# Altium project RX_Board.PrjPcb (part 3 of 5)
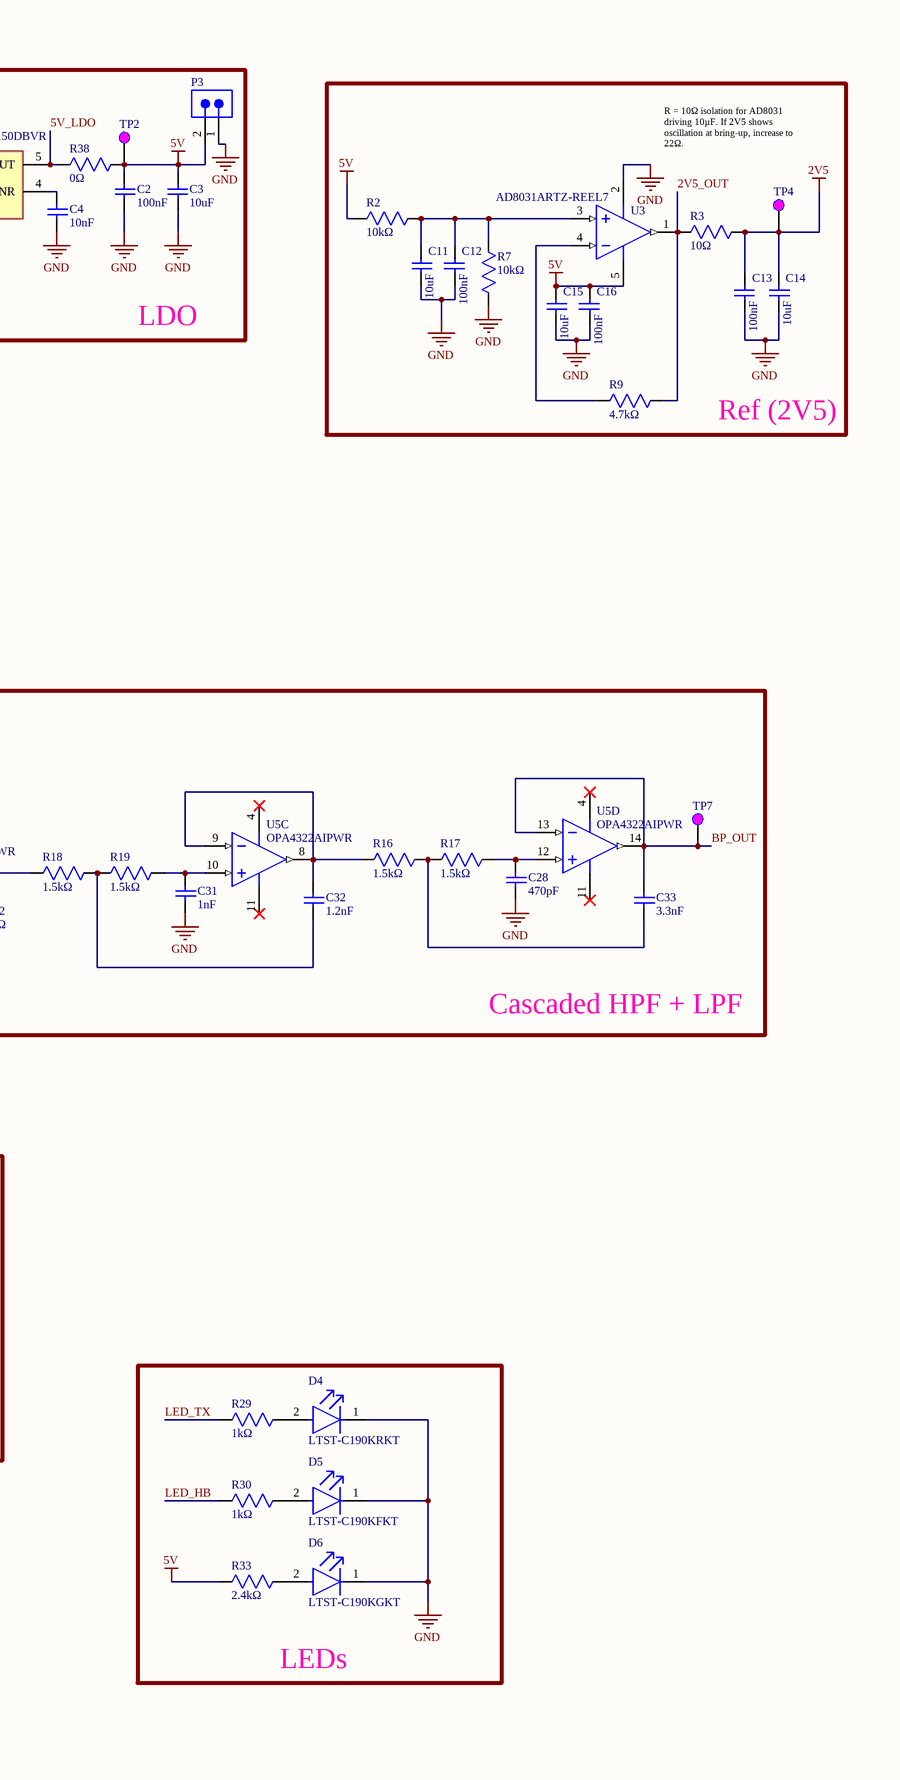
[diagram p3: RX_Board.SchDoc, right]

## Sheet RX_Board.SchDoc (continued)

### Library data of the parts (continued)
C28 = CC0603FRNPO9BN471: 50V 470pF NP0 ±1% 0603 Multilayer Ceramic Capacitors MLCC - SMD/SMT ROHS; Manufacturer: Yageo Group; Dielectric: C0G; Dissipation Factor: 0.1%; Insulation Resistance: 10GΩ; Supplier: Newark; Supplier Part Number: CC0603FRNPO9BN471; Manufacturer Part Number: CC0603FRNPO9BN471; RoHS: Compliant; Category: Ceramic Capacitors; Stock: 7080; Pricing: 1=0.0986, 11=0.0703, 101=0.0582, 501=0.0554, 1001=0.0547 (USD); Value: 470pF; Case/Package: 0603; Case Code (Imperial): 0603; Case Code (Metric): 1608; China RoHS: Compliant; Composition: Ceramic; Depth: 800µm; Dielectric Material: Ceramic; Halogen Free: Halogen Free; Height: 800µm; Lead Free: Lead Free; Length: 1.6mm; Lifecycle Status: Production; Max Operating Temperature: 125°C; Min Operating Temperature: -55°C; Mounting Technology: Surface Mount; Number of Terminals: 2; Packaging: Tape and Reel; Radiation Hardening: No; REACH SVHC: Unaffected; Schedule B: 8532240020, 8532240020|8532240020, 8532240020|8532240020|8532240020, 8532240020|8532240020|8532240020|8532240020; Termination: SMD/SMT; Thickness: 889µm; Tolerance: 1%; Voltage Rating: 50V; Voltage Rating (DC): 50V; Width: 800µm; ComponentLink1URL: https://datasheet.octopart.com:443/CC0603FRNPO9BN471-Yageo-datasheet-182140217.pdf?src-supplier=IHS; ComponentLink1Description: https://datasheet.octopart.com:443/CC0603FRNPO9BN471-Yageo-datasheet-182140217.pdf?src-supplier=IHS; ComponentLink2URL: https://datasheet.octopart.com:443/CC0603FRNPO9BN471-Yageo-datasheet-151948684.pdf?src-supplier=HQonline; ComponentLink2Description: https://datasheet.octopart.com:443/CC0603FRNPO9BN471-Yageo-datasheet-151948684.pdf?src-supplier=HQonline; ComponentLink3URL: https://datasheet.octopart.com:443/CC0603FRNPO9BN471-Yageo-datasheet-182029577.pdf?src-supplier=Newark; ComponentLink3Description: https://datasheet.octopart.com:443/CC0603FRNPO9BN471-Yageo-datasheet-182029577.pdf?src-supplier=Newark; ComponentLink4URL: https://datasheet.octopart.com:443/CC0603FRNPO9BN471-Yageo-datasheet-182029576.pdf?src-supplier=Newark; ComponentLink4Description: https://datasheet.octopart.com:443/CC0603FRNPO9BN471-Yageo-datasheet-182029576.pdf?src-supplier=Newark; ComponentLink5URL: https://datasheet.octopart.com:443/CC0603FRNPO9BN471-Yageo-Group-datasheet-188129580.pdf?src-supplier=LCSC; ComponentLink5Description: https://datasheet.octopart.com:443/CC0603FRNPO9BN471-Yageo-Group-datasheet-188129580.pdf?src-supplier=LCSC; ComponentLink6URL: https://datasheet.octopart.com:443/CC0603FRNPO9BN471-Yageo-datasheet-137875056.pdf?src-supplier=Future+Electronics; ComponentLink6Description: https://datasheet.octopart.com:443/CC0603FRNPO9BN471-Yageo-datasheet-137875056.pdf?src-supplier=Future+Electronics; ComponentLink7URL: https://datasheet.octopart.com:443/CC0603FRNPO9BN471-Yageo-datasheet-136957424.pdf?src-supplier=Future+Electronics; ComponentLink7Description: https://datasheet.octopart.com:443/CC0603FRNPO9BN471-Yageo-datasheet-136957424.pdf?src-supplier=Future+Electronics; ComponentLink8URL: https://datasheet.octopart.com:443/CC0603FRNPO9BN471-Yageo-datasheet-137700082.pdf?src-supplier=Future+Electronics; ComponentLink8Description: https://datasheet.octopart.com:443/CC0603FRNPO9BN471-Yageo-datasheet-137700082.pdf?src-supplier=Future+Electronics; ComponentLink9URL: https://datasheet.octopart.com:443/CC0603FRNPO9BN471-Yageo-datasheet-78855684.pdf?src-supplier=Future+Electronics; ComponentLink9Description: https://datasheet.octopart.com:443/CC0603FRNPO9BN471-Yageo-datasheet-78855684.pdf?src-supplier=Future+Electronics; ComponentLink10URL: https://datasheet.octopart.com:443/CC0603FRNPO9BN471-Yageo-datasheet-16730043.pdf?src-supplier=Future+Electronics; ComponentLink10Description: https://datasheet.octopart.com:443/CC0603FRNPO9BN471-Yageo-datasheet-16730043.pdf?src-supplier=Future+Electronics; ComponentLink11URL: https://datasheet.octopart.com:443/CC0603FRNPO9BN471-Yageo-datasheet-15895757.pdf?src-supplier=Future+Electronics; ComponentLink11Description: https://datasheet.octopart.com:443/CC0603FRNPO9BN471-Yageo-datasheet-15895757.pdf?src-supplier=Future+Electronics; ComponentLink12URL: https://datasheet.octopart.com:443/CC0603FRNPO9BN471-Yageo-datasheet-12589826.pdf?src-supplier=Future+Electronics; ComponentLink12Description: https://datasheet.octopart.com:443/CC0603FRNPO9BN471-Yageo-datasheet-12589826.pdf?src-supplier=Future+Electronics; ComponentLink13URL: https://datasheet.octopart.com:443/CC0603FRNPO9BN471-Yageo-datasheet-10406438.pdf?src-supplier=Future+Electronics; ComponentLink13Description: https://datasheet.octopart.com:443/CC0603FRNPO9BN471-Yageo-datasheet-10406438.pdf?src-supplier=Future+Electronics; ComponentLink14URL: http://sigma.octopart.com:80/conflict_mineral_statement/Yageo-company-3.pdf?src-supplier=Compliance+Statements; ComponentLink14Description: http://sigma.octopart.com:80/conflict_mineral_statement/Yageo-company-3.pdf?src-supplier=Compliance+Statements; ComponentLink15URL: http://sigma.octopart.com:80/rohs_statement/Yageo-company-2.pdf?src-supplier=Compliance+Statements; ComponentLink15Description: http://sigma.octopart.com:80/rohs_statement/Yageo-company-2.pdf?src-supplier=Compliance+Statements; JLCPCB Part Number: C519564
C32 = CC0603JRNPO9BN122: 50V 1.2nF NP0 ±5% 0603 Multilayer Ceramic Capacitors MLCC - SMD/SMT ROHS; Manufacturer: Yageo Group; Supplier: Newark; Supplier Part Number: CC0603JRNPO9BN122; Manufacturer Part Number: CC0603JRNPO9BN122; RoHS: Compliant; Category: Ceramic Capacitors; Stock: 4890; Pricing: 10=0.09, 20=0.088, 30=0.085, 50=0.083, 100=0.08, 250=0.079, 500=0.078, 1000=0.057 (USD); Value: 1.2nF; Case/Package: 0603; China RoHS: Compliant; Dielectric Material: Ceramic; Halogen Free: Halogen Free; Height: 800µm; Lead Free: Lead Free; Length: 1.6mm; Lifecycle Status: Production; Max Operating Temperature: 125°C; Min Operating Temperature: -55°C; Mounting Technology: Surface Mount; Number of Terminals: 2; Packaging: Tape & Reel (TR); REACH SVHC: Unaffected; Thickness: 889µm; Tolerance: 5%; Voltage Rating: 50V; Voltage Rating (DC): 50V; Width: 800µm; ComponentLink1URL: https://datasheet.octopart.com:443/CC0603JRNPO9BN122-Yageo-datasheet-182140217.pdf?src-supplier=IHS; ComponentLink1Description: https://datasheet.octopart.com:443/CC0603JRNPO9BN122-Yageo-datasheet-182140217.pdf?src-supplier=IHS; ComponentLink2URL: https://datasheet.octopart.com:443/CC0603JRNPO9BN122-Yageo-datasheet-182029623.pdf?src-supplier=Farnell; ComponentLink2Description: https://datasheet.octopart.com:443/CC0603JRNPO9BN122-Yageo-datasheet-182029623.pdf?src-supplier=Farnell; ComponentLink3URL: https://datasheet.octopart.com:443/CC0603JRNPO9BN122-Yageo-Group-datasheet-188129580.pdf?src-supplier=LCSC; ComponentLink3Description: https://datasheet.octopart.com:443/CC0603JRNPO9BN122-Yageo-Group-datasheet-188129580.pdf?src-supplier=LCSC; ComponentLink4URL: https://datasheet.octopart.com:443/CC0603JRNPO9BN122-Yageo-datasheet-137875056.pdf?src-supplier=Future+Electronics; ComponentLink4Description: https://datasheet.octopart.com:443/CC0603JRNPO9BN122-Yageo-datasheet-137875056.pdf?src-supplier=Future+Electronics; ComponentLink5URL: https://datasheet.octopart.com:443/CC0603JRNPO9BN122-Yageo-datasheet-136957424.pdf?src-supplier=Future+Electronics; ComponentLink5Description: https://datasheet.octopart.com:443/CC0603JRNPO9BN122-Yageo-datasheet-136957424.pdf?src-supplier=Future+Electronics; ComponentLink6URL: https://datasheet.octopart.com:443/CC0603JRNPO9BN122-Yageo-datasheet-137700082.pdf?src-supplier=Future+Electronics; ComponentLink6Description: https://datasheet.octopart.com:443/CC0603JRNPO9BN122-Yageo-datasheet-137700082.pdf?src-supplier=Future+Electronics; ComponentLink7URL: https://datasheet.octopart.com:443/CC0603JRNPO9BN122-Yageo-datasheet-78855684.pdf?src-supplier=Future+Electronics; ComponentLink7Description: https://datasheet.octopart.com:443/CC0603JRNPO9BN122-Yageo-datasheet-78855684.pdf?src-supplier=Future+Electronics; ComponentLink8URL: https://datasheet.octopart.com:443/CC0603JRNPO9BN122-Yageo-datasheet-62126864.pdf?src-supplier=Future+Electronics; ComponentLink8Description: https://datasheet.octopart.com:443/CC0603JRNPO9BN122-Yageo-datasheet-62126864.pdf?src-supplier=Future+Electronics; ComponentLink9URL: https://datasheet.octopart.com:443/CC0603JRNPO9BN122-Yageo-datasheet-62091628.pdf?src-supplier=Future+Electronics; ComponentLink9Description: https://datasheet.octopart.com:443/CC0603JRNPO9BN122-Yageo-datasheet-62091628.pdf?src-supplier=Future+Electronics; ComponentLink10URL: https://datasheet.octopart.com:443/CC0603JRNPO9BN122-Yageo-datasheet-24578986.pdf?src-supplier=Future+Electronics; ComponentLink10Description: https://datasheet.octopart.com:443/CC0603JRNPO9BN122-Yageo-datasheet-24578986.pdf?src-supplier=Future+Electronics; ComponentLink11URL: https://datasheet.octopart.com:443/CC0603JRNPO9BN122-Yageo-datasheet-10406438.pdf?src-supplier=Future+Electronics; ComponentLink11Description: https://datasheet.octopart.com:443/CC0603JRNPO9BN122-Yageo-datasheet-10406438.pdf?src-supplier=Future+Electronics; ComponentLink12URL: http://sigma.octopart.com:80/conflict_mineral_statement/Yageo-company-3.pdf?src-supplier=Compliance+Statements; ComponentLink12Description: http://sigma.octopart.com:80/conflict_mineral_statement/Yageo-company-3.pdf?src-supplier=Compliance+Statements; ComponentLink13URL: http://sigma.octopart.com:80/rohs_statement/Yageo-company-2.pdf?src-supplier=Compliance+Statements; ComponentLink13Description: http://sigma.octopart.com:80/rohs_statement/Yageo-company-2.pdf?src-supplier=Compliance+Statements; JLCPCB Part Number: C576816
C33 C43 = CC0603JRNPO9BN332: 50V 3.3nF NP0 ±5% 0603 Multilayer Ceramic Capacitors MLCC - SMD/SMT ROHS; Manufacturer: Yageo Group; Dielectric: C0G; Supplier: Newark; Supplier Part Number: CC0603JRNPO9BN332; Manufacturer Part Number: CC0603JRNPO9BN332; RoHS: Compliant; Category: Ceramic Capacitors; Stock: 69; Pricing: 10=0.116, 20=0.113, 30=0.11, 50=0.106, 100=0.103, 250=0.092, 500=0.08, 1000=0.073 (USD); Value: 3.3nF; Case/Package: 0603; Case Code (Imperial): 0603; Case Code (Metric): 1608; China RoHS: Compliant; Composition: Ceramic; Country of Origin: Mainland China, Taiwan; Dielectric Material: Ceramic; Export Control Classification Number (ECCN) Code: EAR99; Halogen Free: Halogen Free; Height: 800µm; Harmonized Tariff Schedule (HTS) Code: 8532.24.00.20; Introduction Date: 2014-02-18; Lead Free: Lead Free; Length: 1.6mm; Lifecycle Status: Production; Max Operating Temperature: 125°C; Min Operating Temperature: -55°C; Mounting Technology: Surface Mount; Number of Terminals: 2; REACH SVHC: Unaffected; Schedule B: 8532240020, 8532240020|8532240020|8532240020|8532240020|8532240020; Termination: SMD/SMT; Thickness: 889µm; Tolerance: 5%; Voltage Rating: 50V; Voltage Rating (DC): 50V; Weight: 2.012816mg; Width: 800µm; ComponentLink1URL: https://datasheet.octopart.com:443/CC0603JRNPO9BN332-Yageo-datasheet-182140217.pdf?src-supplier=IHS; ComponentLink1Description: https://datasheet.octopart.com:443/CC0603JRNPO9BN332-Yageo-datasheet-182140217.pdf?src-supplier=IHS; ComponentLink2URL: https://datasheet.octopart.com:443/CC0603JRNPO9BN332-Yageo-datasheet-182029633.pdf?src-supplier=Newark; ComponentLink2Description: https://datasheet.octopart.com:443/CC0603JRNPO9BN332-Yageo-datasheet-182029633.pdf?src-supplier=Newark; ComponentLink3URL: https://datasheet.octopart.com:443/CC0603JRNPO9BN332-Yageo-datasheet-151948684.pdf?src-supplier=element14+APAC; ComponentLink3Description: https://datasheet.octopart.com:443/CC0603JRNPO9BN332-Yageo-datasheet-151948684.pdf?src-supplier=element14+APAC; ComponentLink4URL: https://datasheet.octopart.com:443/CC0603JRNPO9BN332-Yageo-datasheet-137875056.pdf?src-supplier=Future+Electronics; ComponentLink4Description: https://datasheet.octopart.com:443/CC0603JRNPO9BN332-Yageo-datasheet-137875056.pdf?src-supplier=Future+Electronics; ComponentLink5URL: https://datasheet.octopart.com:443/CC0603JRNPO9BN332-Yageo-datasheet-137700082.pdf?src-supplier=Future+Electronics; ComponentLink5Description: https://datasheet.octopart.com:443/CC0603JRNPO9BN332-Yageo-datasheet-137700082.pdf?src-supplier=Future+Electronics; ComponentLink6URL: http://sigma.octopart.com:80/conflict_mineral_statement/Yageo-company-3.pdf?src-supplier=Compliance+Statements; ComponentLink6Description: http://sigma.octopart.com:80/conflict_mineral_statement/Yageo-company-3.pdf?src-supplier=Compliance+Statements; ComponentLink7URL: http://sigma.octopart.com:80/rohs_statement/Yageo-company-2.pdf?src-supplier=Compliance+Statements; ComponentLink7Description: http://sigma.octopart.com:80/rohs_statement/Yageo-company-2.pdf?src-supplier=Compliance+Statements; JLCPCB Part Number: C107048
C35 C42 = CC0603JRNPO9BN680: Multilayer Ceramic Capacitor, 68 pF, 50 V, ± 5%, C0G (NP0), 0603 [1608 Metric]; Manufacturer: Yageo Group; Dissipation Factor: 0.1%; Temperature Coefficient: 30ppm/°C; Voltage: 50V; Supplier: Avnet; Supplier Part Number: CC0603JRNPO9BN680; Manufacturer Part Number: CC0603JRNPO9BN680; RoHS: Compliant; Category: Ceramic Capacitors; Stock: 37; Pricing: 1=0.112, 25=0.033, 100=0.028, 250=0.025, 500=0.021, 1000=0.019, 2500=0.017 (USD); Value: 68pF; Case/Package: 0603; Case Code (Imperial): 0603; China RoHS: Compliant; Composition: Ceramic; Country of Origin: Mainland China, Taiwan; Depth: 800µm; Dielectric: C0G; Dielectric Material: Ceramic; Export Control Classification Number (ECCN) Code: EAR99; Halogen Free: Halogen Free; Height: 800µm; Harmonized Tariff Schedule (HTS) Code: 8532.24.00.20; Introduction Date: 2009-04-16; Lead Free: Lead Free; Length: 1.6mm; Lifecycle Status: Production; Max Operating Temperature: 125°C; Min Operating Temperature: -55°C; Mounting Technology: Surface Mount; Pins: 2; Number of Terminals: 2; Radiation Hardening: No; REACH SVHC: Unaffected; Schedule B: 8532240020, 8532240020|8532240020, 8532240020|8532240020|8532240020, 8532240020|8532240020|8532240020|8532240020; Termination: SMD/SMT; Thickness: 889µm; Tolerance: 5%; Voltage Rating: 50V; Voltage Rating (AC): 50V; Voltage Rating (DC): 50V; Width: 800µm; ComponentLink1URL: https://datasheet.octopart.com:443/CC0603JRNPO9BN680-Yageo-datasheet-182140217.pdf?src-supplier=IHS; ComponentLink1Description: https://datasheet.octopart.com:443/CC0603JRNPO9BN680-Yageo-datasheet-182140217.pdf?src-supplier=IHS; ComponentLink2URL: https://datasheet.octopart.com:443/CC0603JRNPO9BN680-Yageo-datasheet-78855684.pdf?src-supplier=Upverter; ComponentLink2Description: https://datasheet.octopart.com:443/CC0603JRNPO9BN680-Yageo-datasheet-78855684.pdf?src-supplier=Upverter; ComponentLink3URL: https://datasheet.octopart.com:443/CC0603JRNPO9BN680-Yageo-datasheet-10406438.pdf?src-supplier=element14+APAC; ComponentLink3Description: https://datasheet.octopart.com:443/CC0603JRNPO9BN680-Yageo-datasheet-10406438.pdf?src-supplier=element14+APAC; ComponentLink4URL: https://datasheet.octopart.com:443/CC0603JRNPO9BN680-Yageo-datasheet-65873193.pdf?src-supplier=element14+APAC; ComponentLink4Description: https://datasheet.octopart.com:443/CC0603JRNPO9BN680-Yageo-datasheet-65873193.pdf?src-supplier=element14+APAC; ComponentLink5URL: https://datasheet.octopart.com:443/CC0603JRNPO9BN680-Phycomp-datasheet-5321569.pdf?src-supplier=Newark; ComponentLink5Description: https://datasheet.octopart.com:443/CC0603JRNPO9BN680-Phycomp-datasheet-5321569.pdf?src-supplier=Newark; ComponentLink6URL: https://datasheet.octopart.com:443/CC0603JRNPO9BN680-Yageo-datasheet-151948684.pdf?src-supplier=Newark; ComponentLink6Description: https://datasheet.octopart.com:443/CC0603JRNPO9BN680-Yageo-datasheet-151948684.pdf?src-supplier=Newark; ComponentLink7URL: https://datasheet.octopart.com:443/CC0603JRNPO9BN680-Yageo-datasheet-67645495.pdf?src-supplier=Newark; ComponentLink7Description: https://datasheet.octopart.com:443/CC0603JRNPO9BN680-Yageo-datasheet-67645495.pdf?src-supplier=Newark; ComponentLink8URL: https://datasheet.octopart.com:443/CC0603JRNPO9BN680-Yageo-datasheet-181968266.pdf?src-supplier=Farnell; ComponentLink8Description: https://datasheet.octopart.com:443/CC0603JRNPO9BN680-Yageo-datasheet-181968266.pdf?src-supplier=Farnell; ComponentLink9URL: https://datasheet.octopart.com:443/CC0603JRNPO9BN680-Yageo-datasheet-181968263.pdf?src-supplier=Farnell; ComponentLink9Description: https://datasheet.octopart.com:443/CC0603JRNPO9BN680-Yageo-datasheet-181968263.pdf?src-supplier=Farnell; ComponentLink10URL: https://datasheet.octopart.com:443/CC0603JRNPO9BN680-Yageo-datasheet-10882999.pdf?src-supplier=Farnell; ComponentLink10Description: https://datasheet.octopart.com:443/CC0603JRNPO9BN680-Yageo-datasheet-10882999.pdf?src-supplier=Farnell; ComponentLink11URL: https://datasheet.octopart.com:443/CC0603JRNPO9BN680-Yageo-datasheet-10621397.pdf?src-supplier=Farnell; ComponentLink11Description: https://datasheet.octopart.com:443/CC0603JRNPO9BN680-Yageo-datasheet-10621397.pdf?src-supplier=Farnell; ComponentLink12URL: https://datasheet.octopart.com:443/CC0603JRNPO9BN680-Yageo-datasheet-8817079.pdf?src-supplier=element14; ComponentLink12Description: https://datasheet.octopart.com:443/CC0603JRNPO9BN680-Yageo-datasheet-8817079.pdf?src-supplier=element14; ComponentLink13URL: https://datasheet.octopart.com:443/CC0603JRNPO9BN680-Yageo-datasheet-8324240.pdf?src-supplier=element14; ComponentLink13Description: https://datasheet.octopart.com:443/CC0603JRNPO9BN680-Yageo-datasheet-8324240.pdf?src-supplier=element14; ComponentLink14URL: https://datasheet.octopart.com:443/CC0603JRNPO9BN680-Yageo-datasheet-504625.pdf?src-supplier=element14; ComponentLink14Description: https://datasheet.octopart.com:443/CC0603JRNPO9BN680-Yageo-datasheet-504625.pdf?src-supplier=element14; ComponentLink15URL: https://datasheet.octopart.com:443/CC0603JRNPO9BN680-Yageo-Group-datasheet-188129580.pdf?src-supplier=LCSC; ComponentLink15Description: https://datasheet.octopart.com:443/CC0603JRNPO9BN680-Yageo-Group-datasheet-188129580.pdf?src-supplier=LCSC; ComponentLink16URL: https://datasheet.octopart.com:443/CC0603JRNPO9BN680-Yageo-datasheet-137875056.pdf?src-supplier=Future+Electronics; ComponentLink16Description: https://datasheet.octopart.com:443/CC0603JRNPO9BN680-Yageo-datasheet-137875056.pdf?src-supplier=Future+Electronics; ComponentLink17URL: https://datasheet.octopart.com:443/CC0603JRNPO9BN680-Yageo-datasheet-136957424.pdf?src-supplier=Future+Electronics; ComponentLink17Description: https://datasheet.octopart.com:443/CC0603JRNPO9BN680-Yageo-datasheet-136957424.pdf?src-supplier=Future+Electronics; ComponentLink18URL: https://datasheet.octopart.com:443/CC0603JRNPO9BN680-Yageo-datasheet-137700082.pdf?src-supplier=Future+Electronics; ComponentLink18Description: https://datasheet.octopart.com:443/CC0603JRNPO9BN680-Yageo-datasheet-137700082.pdf?src-supplier=Future+Electronics; ComponentLink19URL: https://datasheet.octopart.com:443/CC0603JRNPO9BN680-Yageo-datasheet-62091628.pdf?src-supplier=Future+Electronics; ComponentLink19Description: https://datasheet.octopart.com:443/CC0603JRNPO9BN680-Yageo-datasheet-62091628.pdf?src-supplier=Future+Electronics; ComponentLink20URL: https://datasheet.octopart.com:443/CC0603JRNPO9BN680-Yageo-datasheet-24578986.pdf?src-supplier=Future+Electronics; ComponentLink20Description: https://datasheet.octopart.com:443/CC0603JRNPO9BN680-Yageo-datasheet-24578986.pdf?src-supplier=Future+Electronics; ComponentLink21URL: https://datasheet.octopart.com:443/CC0603JRNPO9BN680-Yageo-datasheet-16730043.pdf?src-supplier=Future+Electronics; ComponentLink21Description: https://datasheet.octopart.com:443/CC0603JRNPO9BN680-Yageo-datasheet-16730043.pdf?src-supplier=Future+Electronics; ComponentLink22URL: https://datasheet.octopart.com:443/CC0603JRNPO9BN680-Yageo-datasheet-15895757.pdf?src-supplier=Future+Electronics; ComponentLink22Description: https://datasheet.octopart.com:443/CC0603JRNPO9BN680-Yageo-datasheet-15895757.pdf?src-supplier=Future+Electronics; ComponentLink23URL: https://datasheet.octopart.com:443/CC0603JRNPO9BN680-Yageo-datasheet-12589826.pdf?src-supplier=Future+Electronics; ComponentLink23Description: https://datasheet.octopart.com:443/CC0603JRNPO9BN680-Yageo-datasheet-12589826.pdf?src-supplier=Future+Electronics; ComponentLink24URL: https://datasheet.octopart.com:443/CC0603JRNPO9BN680-Yageo-datasheet-8643175.pdf?src-supplier=SOS+electronic; ComponentLink24Description: https://datasheet.octopart.com:443/CC0603JRNPO9BN680-Yageo-datasheet-8643175.pdf?src-supplier=SOS+electronic; ComponentLink25URL: https://datasheet.octopart.com:443/CC0603JRNPO9BN680-Yageo-datasheet-8555986.pdf?src-supplier=TME; ComponentLink25Description: https://datasheet.octopart.com:443/CC0603JRNPO9BN680-Yageo-datasheet-8555986.pdf?src-supplier=TME; ComponentLink26URL: http://sigma.octopart.com:80/conflict_mineral_statement/Yageo-company-3.pdf?src-supplier=Compliance+Statements; ComponentLink26Description: http://sigma.octopart.com:80/conflict_mineral_statement/Yageo-company-3.pdf?src-supplier=Compliance+Statements; ComponentLink27URL: http://sigma.octopart.com:80/rohs_statement/Yageo-company-2.pdf?src-supplier=Compliance+Statements; ComponentLink27Description: http://sigma.octopart.com:80/rohs_statement/Yageo-company-2.pdf?src-supplier=Compliance+Statements; JLCPCB Part Number: C62782
C45 = CL10B105KB8NQNC: MLCC - 0603 50 V X7R 1 uF 10 % Multilayer Ceramic Capacitor; Manufacturer: Samsung Electro-Mechanics; Tolerance: 10%; Voltage Rating (DC): 50V; Supplier: Future Electronics; Supplier Part Number: CL10B105KB8NQNC; Manufacturer Part Number: CL10B105KB8NQNC; RoHS: Compliant; Category: Ceramic Capacitors; Stock: 52000; Pricing: 4000=0.0293, 8000=0.0289, 16000=0.0284, 20000=0.0283, 60000=0.0274 (USD); Value: 1µF; Case/Package: 0603; China RoHS: Compliant; Dielectric Material: Ceramic; Height: 800µm; Length: 1.6mm; Lifecycle Status: Production; Max Operating Temperature: 125°C; Min Operating Temperature: -55°C; Mounting Technology: Surface Mount; Number of Terminals: 2; REACH SVHC: Unaffected; Width: 800µm; ComponentLink1URL: https://datasheet.octopart.com:443/CL10B105KB8NQNC-Samsung-Electro-Mechanics-datasheet-182019892.pdf?src-supplier=IHS; ComponentLink1Description: https://datasheet.octopart.com:443/CL10B105KB8NQNC-Samsung-Electro-Mechanics-datasheet-182019892.pdf?src-supplier=IHS; ComponentLink2URL: https://datasheet.octopart.com:443/CL10B105KB8NQNC-Samsung-datasheet-8326407.pdf?src-supplier=TME; ComponentLink2Description: https://datasheet.octopart.com:443/CL10B105KB8NQNC-Samsung-datasheet-8326407.pdf?src-supplier=TME; ComponentLink3URL: https://datasheet.octopart.com:443/CL10B105KB8NQNC-Samsung-Electro-Mechanics-datasheet-168551976.pdf?src-supplier=Future+Electronics; ComponentLink3Description: https://datasheet.octopart.com:443/CL10B105KB8NQNC-Samsung-Electro-Mechanics-datasheet-168551976.pdf?src-supplier=Future+Electronics; JLCPCB Part Number: C5199872
D1 = SS34: -55℃~+125℃ 3A 40V 500uA@40V 550mV@3A Independent SMA(DO-214AC) Schottky Diodes ROHS; Manufacturer: MDD; Manufacturer Part Number: SS34; Category: Schottky Diodes; JLCPCB Part Number: C8678
D2 = SMAJ15A: SMAJ Series 24.4 V 400 W Surface Mount Uni-Directional TVS Diode - DO-214AC; Manufacturer: Littelfuse; Breakdown Voltage: 17.6V; Clamping Voltage: 24.4V; Direction: Unidirectional; Element Configuration: Single; Forward Voltage: 3.5V; Leakage Current: 1µA; Max Breakdown Voltage: 18.5V; Max Junction Temperature (Tj): 150°C; Max Power Dissipation: 3.3W; Max Surge Current: 16.4A; Min Breakdown Voltage: 16.7V; Number of Channels: 1; Operating Supply Voltage: 15V; Peak Pulse Power: 400W; Power Line Protection: No; Test Current: 1mA; Supplier: Future Electronics; Supplier Part Number: SMAJ15A; Manufacturer Part Number: SMAJ15A; RoHS: Compliant; Category: TVS Diodes; Stock: 635000; Pricing: 5000=0.0662, 10000=0.0652, 15000=0.0646, 25000=0.0638, 50000=0.0622 (USD); Composition: Zener; Country of Origin: Mainland China; Export Control Classification Number (ECCN) Code: EAR99; Height: 2.29mm; Harmonized Tariff Schedule (HTS) Code: 8541.10.00.50; Introduction Date: 2003-11-20; Lead Free: Lead Free; Length: 4.5mm; Lifecycle Status: Production; Max Operating Temperature: 150°C; Max Reverse Leakage Current: 1µA; Min Operating Temperature: -65°C; Mounting Technology: Surface Mount; Number of Elements: 1; Pins: 2; Number of Terminals: 2; Number of Unidirectional Channels: 1; Packaging: Tape & Reel; Peak Pulse Current: 16.4A; Peak Reverse Current: 1µA; Polarity: Unidirectional; Power Dissipation: 400W; Power Rating: 400W; Radiation Hardening: No; REACH SVHC: Affected; Reverse Breakdown Voltage: 16.7V; Reverse Standoff Voltage: 15V; Reverse Voltage: 15V; Schedule B: 8541100080, 8541100080|8541100080|8541100080|8541100080|8541100080; Termination: SMD/SMT; Voltage Rating (DC): 15V; Width: 2.79mm; ComponentLink1URL: https://datasheet.octopart.com:443/SMAJ15A-Littelfuse-datasheet-150463581.pdf?src-supplier=Farnell; ComponentLink1Description: https://datasheet.octopart.com:443/SMAJ15A-Littelfuse-datasheet-150463581.pdf?src-supplier=Farnell; ComponentLink2URL: https://datasheet.octopart.com:443/SMAJ15A-Littelfuse-datasheet-63710798.pdf?src-supplier=Farnell; ComponentLink2Description: https://datasheet.octopart.com:443/SMAJ15A-Littelfuse-datasheet-63710798.pdf?src-supplier=Farnell; ComponentLink3URL: https://datasheet.octopart.com:443/SMAJ15A-Littelfuse-datasheet-11547152.pdf?src-supplier=element14+APAC; ComponentLink3Description: https://datasheet.octopart.com:443/SMAJ15A-Littelfuse-datasheet-11547152.pdf?src-supplier=element14+APAC; ComponentLink4URL: https://datasheet.octopart.com:443/SMAJ15A-Littelfuse-datasheet-5393952.pdf?src-supplier=element14+APAC; ComponentLink4Description: https://datasheet.octopart.com:443/SMAJ15A-Littelfuse-datasheet-5393952.pdf?src-supplier=element14+APAC; ComponentLink5URL: https://datasheet.octopart.com:443/SMAJ15A-Littelfuse-datasheet-511791.pdf?src-supplier=element14+APAC; ComponentLink5Description: https://datasheet.octopart.com:443/SMAJ15A-Littelfuse-datasheet-511791.pdf?src-supplier=element14+APAC; ComponentLink6URL: https://datasheet.octopart.com:443/SMAJ15A-Littelfuse-datasheet-1053.pdf?src-supplier=DigiKey; ComponentLink6Description: https://datasheet.octopart.com:443/SMAJ15A-Littelfuse-datasheet-1053.pdf?src-supplier=DigiKey; ComponentLink7URL: https://datasheet.octopart.com:443/SMAJ15A-Littelfuse-datasheet-164649624.pdf?src-supplier=JRH+Electronics; ComponentLink7Description: https://datasheet.octopart.com:443/SMAJ15A-Littelfuse-datasheet-164649624.pdf?src-supplier=JRH+Electronics; ComponentLink8URL: https://datasheet.octopart.com:443/SMAJ15A-Littelfuse-datasheet-38878911.pdf?src-supplier=RS+(Formerly+Allied+Electronics); ComponentLink8Description: https://datasheet.octopart.com:443/SMAJ15A-Littelfuse-datasheet-38878911.pdf?src-supplier=RS+(Formerly+Allied+Electronics); ComponentLink9URL: https://datasheet.octopart.com:443/SMAJ15A-Littelfuse-datasheet-17901671.pdf?src-supplier=Future+Electronics; ComponentLink9Description: https://datasheet.octopart.com:443/SMAJ15A-Littelfuse-datasheet-17901671.pdf?src-supplier=Future+Electronics; JLCPCB Part Number: C148216
D3 = CMP-14399-000006-1: DIODE ARRAY GP 100V 215MA SOT23; JLCPCB Part Number: C2500
D4 = CMP-1674-00011-2: LED RED CLEAR CHIP SMD; Reverse Voltage: 5V; Viewing Angle: 130°; Power Rating: 75mW; Test Current: 20mA; Number of Elements: 1; Lens Color: Colorless; Wavelength: 639nm; Dominant Wavelength: 631nm; Lens Style: Diffused; Forward Current: 30mA; Forward Voltage: 2.4V; Luminous Intensity: 54mcd; Color: Red; Case Code (Imperial): 0603; Lens Transparency: Clear; Lead Free: Lead Free; Package Quantity: 1; Packaging: Tape and Reel; Max Operating Temperature: 85°C; Number of Pins: 2; Height: 0.8mm; Case/Package: 0603; Number of LEDs: 1; Width: 0.8mm; Case Code (Metric): 1608; Depth: 0.8mm; Mount: Surface Mount; Radiation Hardening: No; Length: 1.6mm; Illumination Color: Red; Power Dissipation: 75mW; Min Operating Temperature: -55°C; JLCPCB Part Number: C94869
D5 = CMP-1674-00008-9: LED ORANGE CLEAR CHIP SMD; Luminous Intensity: 90mcd; Viewing Angle: 130°; Wavelength: 611nm; Lens Color: Colorless; Test Current: 20mA; Lens Style: Flat; Reverse Voltage: 5V; Power Dissipation: 75mW; Number of Elements: 1; Forward Current: 30mA; Lens Size: 0.8mm; Dominant Wavelength: 605nm; Forward Voltage: 2V; Min Operating Temperature: -55°C; Lens Transparency: Clear; RoHS Compliant: Yes; Case Code (Metric): 1608; Color: Orange; Width: 0.8mm; Number of Pins: 2; Depth: 1.6mm; Case/Package: 0603; Radiation Hardening: No; Case Code (Imperial): 0603; Max Operating Temperature: 85°C; Number of LEDs: 1; Height: 0.9mm; Mount: Surface Mount; Packaging: Tape and Reel; Length: 3.2mm; Package Quantity: 3000; Power Rating: 75mW; Lead Free: Lead Free; Illumination Color: Orange; Series: -; JLCPCB Part Number: C157740
D6 = CMP-2000-05197-2: LED GREEN CLEAR CHIP SMD; Test Current: 20mA; Power Rating: 75mW; Forward Voltage: 2V; Wavelength: 574nm; Number of LEDs: 1; Reverse Voltage: 5V; Dominant Wavelength: 571nm; Lens Style: Diffused; Luminous Intensity: 35mcd; Forward Current: 30mA; Viewing Angle: 130°; Lens Color: Colorless; Width: 0.8mm; Case Code (Imperial): 0603; Case Code (Metric): 1608; Number of Pins: 2; Radiation Hardening: No; Package Quantity: 1; Lead Free: Lead Free; Lens Transparency: Clear; Depth: 0.8mm; Power Dissipation: 75mW; Mount: Surface Mount; Max Operating Temperature: 85°C; Case/Package: 0603; Height: 0.8mm; Illumination Color: Green; Color: Green; Length: 1.6mm; Packaging: Tape and Reel; Number of Elements: 1; Min Operating Temperature: -55°C; JLCPCB Part Number: C125094
J1 J2 = DB301V-3.5-2P-GN-S: -40℃~+105℃ 0.5~1 1 18~24 1x2P 2 2P 3.5mm 300V 7A 8.5mm Green M2 Through Hole Plugin,P=3.5mm Screw Terminal Blocks ROHS; JLCPCB Part Number: C695629
L1 = SWPA5040S220MT: General Purpose Inductor, 22uH, 20%, 1 Element, Ferrite-Core, SMD, 2020; Manufacturer: Sunlord; DC Resistance (DCR): 168mΩ; Max Current Rating: 1.5A; Number of Circuits: 1; Self Resonant Frequency: 11MHz; Shielding: Shielded; Test Frequency: 100kHz; Supplier: DigiKey; Supplier Part Number: 3442-SWPA5040S220MTCT-ND; Manufacturer Part Number: SWPA5040S220MT; RoHS: Compliant; Category: Fixed Inductors; Stock: 352; Pricing: 1=0.47, 10=0.384, 100=0.3156 (USD); Case/Package: 2020; Core Material: Ferrite; Height: 4mm; Value: 22µH; Length: 5mm; Lifecycle Status: Production; Max Operating Temperature: 125°C; Min Operating Temperature: -40°C; Number of Terminals: 2; REACH SVHC: Unaffected; Tolerance: 20%; Width: 5mm; ComponentLink1URL: https://datasheet.octopart.com:443/SWPA5040S220MT-Sunlord-datasheet-180747130.pdf?src-supplier=IHS; ComponentLink1Description: https://datasheet.octopart.com:443/SWPA5040S220MT-Sunlord-datasheet-180747130.pdf?src-supplier=IHS; JLCPCB Part Number: C68434
MD1 = CMP-157412-000001-1: TEENSY 4.1 (HEADERS)
P1 = CMP-1755-00006-1: Male Header, Pitch 2.5 mm, 1 x 3 Position, Height 6.1 mm, Tail Length 3.4 mm, -25 to 85 degC, RoHS, Bulk; Min Supply Voltage: 1 V; Frequency: 1.8 MHz; Channels: 1; Nominal Supply Current: 170 uA; Max Power Dissipation: 1 W; Max Ouput Current: -10 mA; Case\Package: DIP; Max Supply Voltage: 15 V; Min Operating Temperature: 0 degC; Weight: 0.015535 oz; Radiation Hardening: No; ComponentLink1URL: http://www.jst.com/home2.html; PackageReference: S3B-XH-A(LF)(SN); Length: 9.81 mm; Max Operating Temperature: 70 degC; Package Quantity: 50; REACH SVHC: No SVHC; Mount: Through Hole; Pins: 8; Height: 4.57 mm; DatasheetVersion: May-16; ComponentLink1Description: Manufacturer URL; PackageDescription: Male Header, Pitch 2.5 mm, 1 x 3 Position, Height 6.1 mm, Tail Length 3.4 mm; RoHSCompliant: true; Packaging: Rail/Tube; Width: 6.35 mm; ComponentLink2URL: http://www.jst-mfg.com/product/pdf/eng/eXH.pdf; ComponentLink2Description: Datasheet
P2 = CMP-1502-01062-4: THT Vertical Pin Header WR-PHD, Pitch 2.54 mm, Single Row, 3 pins; Connector Type: Male Pin; Number of Contacts: 3; Operating Supply Voltage: 250V; Current Rating: 3A; Pitch: 2.54mm; Contact Resistance: 20mΩ; Gender: Male; Height: 8.94mm; Color: Black; Min Operating Temperature: -40°C; Max Operating Temperature: 105°C; Mount: Through Hole; Termination: Solder; Number of Rows: 1; Packaging: Bulk; Number of Pins: 3; Lead Pitch: 2.54mm; RoHS: Compliant; Contact Plating: Gold; Number of Positions: 3; Lead Free: Lead Free; Voltage Rating: 250V; Contact Mating Length: 5.9944mm; Orientation: Vertical; Contact Material: Gold
P3 = CMP-1712-00002-7: THT Vertical Pin Header WR-PHD, Pitch 2.54 mm, Single Row, 2 pins; Pitch: 2.54mm; Number of Contacts: 2; Connector Type: Male Pin; Gender: Male; Contact Resistance: 20mΩ; Operating Supply Voltage: 250V; Current Rating: 3A; Housing Material: PBT; RoHS: Compliant; Lead Free: Lead Free; Contact Material: Gold; REACH SVHC: No; Min Operating Temperature: -40°C; Termination: Through Hole; Number of Pins: 2; Contact Gender: Male; Packaging: Bulk; Lead Pitch: 2.54mm; Contact Plating: Gold; Orientation: Vertical; Mount: Through Hole; Height: 8.94mm; Color: Black; Number of Positions: 2; Contact Mating Length: 5.9944mm; Max Operating Temperature: 105°C; Voltage Rating: 250V; Number of Rows: 1
Q1 = LSK170A SOT-23 3L ROHS: Jfet N-ch 40V 10MA SOT23-3; Manufacturer: Linear Systems; Supplier: DigiKey; Supplier Part Number: 4004-LSK170ASOT-233LROHSCT-ND; Manufacturer Part Number: LSK170A SOT-23 3L ROHS; Category: JFETs; Stock: 12881; Pricing: 1=12.45, 10=8.643, 50=7.0152, 100=6.8697 (USD)
R1 = RT0603BRD07560KL: 100mW Thin Film Resistor 75V ±25ppm/℃ ±0.1% 560kΩ 0603 Chip Resistor - Surface Mount ROHS; Manufacturer: Yageo Group; Temperature Coefficient: 25ppm/°C; Supplier: Newark; Supplier Part Number: RT0603BRD07560KL; Manufacturer Part Number: RT0603BRD07560KL; RoHS: Compliant; Category: Chip SMD Resistors; Stock: 4440; Pricing: 10=0.061, 20=0.06, 30=0.059, 50=0.058, 100=0.057, 250=0.054, 500=0.051, 1000=0.05 (USD); Case/Package: 0603; Case Code (Imperial): 0603; Case Code (Metric): 1608; China RoHS: Non-Compliant; Composition: Thin Film; Contact Plating: Tin; Country of Origin: Mainland China, Taiwan; Export Control Classification Number (ECCN) Code: EAR99; Features: Moisture Resistant; Height: 450µm; Harmonized Tariff Schedule (HTS) Code: 8533.21.00.30; Introduction Date: 2008-07-11; Length: 1.6mm; Lifecycle Status: Production; Max Operating Temperature: 155°C; Max Power Dissipation: 100mW; Min Operating Temperature: -55°C; Mounting Technology: Surface Mount; Number of Terminals: 2; Number of Terminations: 2; Packaging: Tape & Reel; Power Rating: 100mW; Radiation Hardening: No; REACH SVHC: Unaffected; Value: 560kΩ; Schedule B: 8533210045, 8533210045|8533210045|8533210045|8533210045|8533210045; Termination: SMD/SMT; Tolerance: 0.1%; Voltage Rating: 75V; Width: 800µm; Working Voltage: 75V; ComponentLink1URL: https://datasheet.octopart.com:443/RT0603BRD07560KL-Yageo-datasheet-176402239.pdf?src-supplier=Future+Electronics; ComponentLink1Description: https://datasheet.octopart.com:443/RT0603BRD07560KL-Yageo-datasheet-176402239.pdf?src-supplier=Future+Electronics; ComponentLink2URL: https://datasheet.octopart.com:443/RT0603BRD07560KL-Yageo-datasheet-169971040.pdf?src-supplier=Future+Electronics; ComponentLink2Description: https://datasheet.octopart.com:443/RT0603BRD07560KL-Yageo-datasheet-169971040.pdf?src-supplier=Future+Electronics; ComponentLink3URL: https://datasheet.octopart.com:443/RT0603BRD07560KL-Yageo-datasheet-166250672.pdf?src-supplier=Future+Electronics; ComponentLink3Description: https://datasheet.octopart.com:443/RT0603BRD07560KL-Yageo-datasheet-166250672.pdf?src-supplier=Future+Electronics; ComponentLink4URL: https://datasheet.octopart.com:443/RT0603BRD07560KL-Yageo-datasheet-96443642.pdf?src-supplier=Upverter; ComponentLink4Description: https://datasheet.octopart.com:443/RT0603BRD07560KL-Yageo-datasheet-96443642.pdf?src-supplier=Upverter; ComponentLink5URL: https://datasheet.octopart.com:443/RT0603BRD07560KL-Yageo-Group-datasheet-141265893.pdf?src-supplier=ODG+(Origin+Data+Global); ComponentLink5Description: https://datasheet.octopart.com:443/RT0603BRD07560KL-Yageo-Group-datasheet-141265893.pdf?src-supplier=ODG+(Origin+Data+Global); ComponentLink6URL: https://datasheet.octopart.com/RT0603BRD07560KL-Yageo-datasheet-86813807.pdf; ComponentLink6Description: https://datasheet.octopart.com/RT0603BRD07560KL-Yageo-datasheet-86813807.pdf; ComponentLink7URL: http://sigma.octopart.com:80/conflict_mineral_statement/Yageo-company-3.pdf?src-supplier=Compliance+Statements; ComponentLink7Description: http://sigma.octopart.com:80/conflict_mineral_statement/Yageo-company-3.pdf?src-supplier=Compliance+Statements; ComponentLink8URL: http://sigma.octopart.com:80/rohs_statement/Yageo-company-2.pdf?src-supplier=Compliance+Statements; ComponentLink8Description: http://sigma.octopart.com:80/rohs_statement/Yageo-company-2.pdf?src-supplier=Compliance+Statements; JLCPCB Part Number: C719312
R2 R7 R12 R34 R35 = RT0603BRD0710KL: Res Thin Film 0603 10K Ohm 0.1% 1/10W |25ppm/|C SMD Paper T/R; Manufacturer: Yageo Group; Max Power Dissipation: 100mW; Temperature Coefficient: 25ppm/°C; Voltage Rating: 75V; Supplier: Avnet; Supplier Part Number: RT0603BRD0710KL; Manufacturer Part Number: RT0603BRD0710KL; RoHS: Compliant; Category: Chip SMD Resistors; Stock: 34896; Pricing: 1=0.127, 25=0.079, 100=0.075, 250=0.07, 500=0.066, 1000=0.064, 2500=0.059 (USD); Case/Package: 0603; Case Code (Imperial): 0603; China RoHS: Non-Compliant; Composition: Thin Film; Country of Origin: Mainland China, Taiwan; Depth: 800µm; Export Control Classification Number (ECCN) Code: EAR99; Features: Moisture Resistant; Height: 450µm; Harmonized Tariff Schedule (HTS) Code: 8533.21.00.30; Introduction Date: 2008-06-09; Lead Free: Lead Free; Length: 1.6mm; Lifecycle Status: Production; Max Operating Temperature: 155°C; Military Standard: Not; Min Operating Temperature: -55°C; Mounting Technology: Surface Mount; Number of Terminals: 2; Number of Terminations: 2; Power Rating: 100mW; REACH SVHC: Unaffected; Value: 10kΩ; Schedule B: 8533210045, 8533210045|8533210045, 8533210045|8533210045|8533210045, 8533210045|8533210045|8533210045|8533210045; Termination: SMD/SMT; Tolerance: 0.1%; Voltage Rating (DC): 75V; Weight: 2.012816mg; Width: 800µm; Working Voltage: 75V; ComponentLink1URL: https://datasheet.octopart.com:443/RT0603BRD0710KL-Yageo-datasheet-176402239.pdf?src-supplier=Future+Electronics; ComponentLink1Description: https://datasheet.octopart.com:443/RT0603BRD0710KL-Yageo-datasheet-176402239.pdf?src-supplier=Future+Electronics; ComponentLink2URL: https://datasheet.octopart.com:443/RT0603BRD0710KL-Yageo-datasheet-169971040.pdf?src-supplier=Future+Electronics; ComponentLink2Description: https://datasheet.octopart.com:443/RT0603BRD0710KL-Yageo-datasheet-169971040.pdf?src-supplier=Future+Electronics; ComponentLink3URL: https://datasheet.octopart.com:443/RT0603BRD0710KL-Yageo-datasheet-166250672.pdf?src-supplier=Future+Electronics; ComponentLink3Description: https://datasheet.octopart.com:443/RT0603BRD0710KL-Yageo-datasheet-166250672.pdf?src-supplier=Future+Electronics; ComponentLink4URL: https://datasheet.octopart.com:443/RT0603BRD0710KL-Yageo-datasheet-136673517.pdf?src-supplier=Future+Electronics; ComponentLink4Description: https://datasheet.octopart.com:443/RT0603BRD0710KL-Yageo-datasheet-136673517.pdf?src-supplier=Future+Electronics; ComponentLink5URL: https://datasheet.octopart.com:443/RT0603BRD0710KL-Yageo-datasheet-137700930.pdf?src-supplier=Future+Electronics; ComponentLink5Description: https://datasheet.octopart.com:443/RT0603BRD0710KL-Yageo-datasheet-137700930.pdf?src-supplier=Future+Electronics; ComponentLink6URL: https://datasheet.octopart.com:443/RT0603BRD0710KL-Yageo-datasheet-12594463.pdf?src-supplier=Future+Electronics; ComponentLink6Description: https://datasheet.octopart.com:443/RT0603BRD0710KL-Yageo-datasheet-12594463.pdf?src-supplier=Future+Electronics; ComponentLink7URL: https://datasheet.octopart.com:443/RT0603BRD0710KL-Yageo-datasheet-8324589.pdf?src-supplier=Future+Electronics; ComponentLink7Description: https://datasheet.octopart.com:443/RT0603BRD0710KL-Yageo-datasheet-8324589.pdf?src-supplier=Future+Electronics; ComponentLink8URL: https://datasheet.octopart.com:443/RT0603BRD0710KL-Yageo-datasheet-34924148.pdf?src-supplier=Future+Electronics; ComponentLink8Description: https://datasheet.octopart.com:443/RT0603BRD0710KL-Yageo-datasheet-34924148.pdf?src-supplier=Future+Electronics; ComponentLink9URL: https://datasheet.octopart.com:443/RT0603BRD0710KL-Yageo-datasheet-10915759.pdf?src-supplier=Upverter; ComponentLink9Description: https://datasheet.octopart.com:443/RT0603BRD0710KL-Yageo-datasheet-10915759.pdf?src-supplier=Upverter; ComponentLink10URL: https://datasheet.octopart.com:443/RT0603BRD0710KL-Yageo-datasheet-96443642.pdf?src-supplier=Upverter; ComponentLink10Description: https://datasheet.octopart.com:443/RT0603BRD0710KL-Yageo-datasheet-96443642.pdf?src-supplier=Upverter; ComponentLink11URL: https://datasheet.octopart.com:443/RT0603BRD0710KL-Yageo-Group-datasheet-188167888.pdf?src-supplier=LCSC; ComponentLink11Description: https://datasheet.octopart.com:443/RT0603BRD0710KL-Yageo-Group-datasheet-188167888.pdf?src-supplier=LCSC; ComponentLink12URL: https://datasheet.octopart.com:443/RT0603BRD0710KL-Yageo-datasheet-164439670.pdf?src-supplier=Newark; ComponentLink12Description: https://datasheet.octopart.com:443/RT0603BRD0710KL-Yageo-datasheet-164439670.pdf?src-supplier=Newark; ComponentLink13URL: https://datasheet.octopart.com:443/RT0603BRD0710KL-Yageo-Group-datasheet-141265893.pdf?src-supplier=ODG+(Origin+Data+Global); ComponentLink13Description: https://datasheet.octopart.com:443/RT0603BRD0710KL-Yageo-Group-datasheet-141265893.pdf?src-supplier=ODG+(Origin+Data+Global); ComponentLink14URL: https://datasheet.octopart.com:443/RT0603BRD0710KL-Yageo-datasheet-120102479.pdf?src-supplier=Megastar; ComponentLink14Description: https://datasheet.octopart.com:443/RT0603BRD0710KL-Yageo-datasheet-120102479.pdf?src-supplier=Megastar; ComponentLink15URL: https://datasheet.octopart.com/RT0603BRD0710KL-Yageo-datasheet-86813807.pdf; ComponentLink15Description: https://datasheet.octopart.com/RT0603BRD0710KL-Yageo-datasheet-86813807.pdf; ComponentLink16URL: http://sigma.octopart.com:80/conflict_mineral_statement/Yageo-company-3.pdf?src-supplier=Compliance+Statements; ComponentLink16Description: http://sigma.octopart.com:80/conflict_mineral_statement/Yageo-company-3.pdf?src-supplier=Compliance+Statements; ComponentLink17URL: http://sigma.octopart.com:80/rohs_statement/Yageo-company-2.pdf?src-supplier=Compliance+Statements; ComponentLink17Description: http://sigma.octopart.com:80/rohs_statement/Yageo-company-2.pdf?src-supplier=Compliance+Statements; JLCPCB Part Number: C95204
R3 = 0603WAF100JT5E: Res Thick Film 0603 10 Ohm 1% 0.1W(1/10W) ±200ppm/C Pad SMD T/R; Manufacturer: Royal Ohm; Supplier: Mouser; Supplier Part Number: 303-0603WAF100JT5E; Manufacturer Part Number: 0603WAF100JT5E; Category: Chip SMD Resistors; Stock: 15000; Pricing: 10000=0.001 (USD); Value: 10Ω; ComponentLink1URL: https://datasheet.octopart.com:443/0603WAF100JT5E-Royal-Ohm-datasheet-165785611.pdf?src-supplier=TME; ComponentLink1Description: https://datasheet.octopart.com:443/0603WAF100JT5E-Royal-Ohm-datasheet-165785611.pdf?src-supplier=TME; ComponentLink2URL: https://datasheet.octopart.com:443/0603WAF100JT5E-Royal-Ohm-datasheet-157855877.pdf?src-supplier=TME; ComponentLink2Description: https://datasheet.octopart.com:443/0603WAF100JT5E-Royal-Ohm-datasheet-157855877.pdf?src-supplier=TME; ComponentLink3URL: https://datasheet.octopart.com:443/0603WAF100JT5E-Royal-Ohm-datasheet-62069544.pdf?src-supplier=TME; ComponentLink3Description: https://datasheet.octopart.com:443/0603WAF100JT5E-Royal-Ohm-datasheet-62069544.pdf?src-supplier=TME; JLCPCB Part Number: C22859
R4 R5 R20 R28 = RT0603BRD07100KL: 100mW Thin Film Resistor 75V ±25ppm/℃ ±0.1% 100kΩ 0603 Chip Resistor - Surface Mount ROHS; Manufacturer: Yageo Group; Temperature Coefficient: 25ppm/°C; Supplier: Avnet; Supplier Part Number: RT0603BRD07100KL; Manufacturer Part Number: RT0603BRD07100KL; RoHS: Compliant; Category: Chip SMD Resistors; Stock: 535000; Pricing: 5000=0.0291, 10000=0.02828, 20000=0.02751, 40000=0.02677, 80000=0.02608 (USD); Case/Package: 0603; Case Code (Imperial): 0603; China RoHS: Non-Compliant; Composition: Thin Film; Contact Plating: Tin; Country of Origin: Mainland China, Taiwan; Depth: 800µm; Export Control Classification Number (ECCN) Code: EAR99; Features: Moisture Resistant; Height: 450µm; Harmonized Tariff Schedule (HTS) Code: 8533.21.00.30; Introduction Date: 2008-06-09; Lead Free: Lead Free; Length: 1.6mm; Lifecycle Status: Production; Max Operating Temperature: 155°C; Max Power Dissipation: 100mW; Military Standard: Not; Min Operating Temperature: -55°C; Mounting Technology: Surface Mount; Number of Terminals: 2; Number of Terminations: 2; Power Rating: 100mW; Radiation Hardening: No; REACH SVHC: Unaffected; Value: 100kΩ; Schedule B: 8533210045, 8533210045|8533210045, 8533210045|8533210045|8533210045, 8533210045|8533210045|8533210045|8533210045; Termination: SMD/SMT; Tolerance: 0.1%; Voltage Rating: 75V; Voltage Rating (DC): 75V; Width: 800µm; Working Voltage: 75V; ComponentLink1URL: https://datasheet.octopart.com:443/RT0603BRD07100KL-Yageo-datasheet-176402239.pdf?src-supplier=Future+Electronics; ComponentLink1Description: https://datasheet.octopart.com:443/RT0603BRD07100KL-Yageo-datasheet-176402239.pdf?src-supplier=Future+Electronics; ComponentLink2URL: https://datasheet.octopart.com:443/RT0603BRD07100KL-Yageo-datasheet-169971040.pdf?src-supplier=Future+Electronics; ComponentLink2Description: https://datasheet.octopart.com:443/RT0603BRD07100KL-Yageo-datasheet-169971040.pdf?src-supplier=Future+Electronics; ComponentLink3URL: https://datasheet.octopart.com:443/RT0603BRD07100KL-Yageo-datasheet-166250672.pdf?src-supplier=Future+Electronics; ComponentLink3Description: https://datasheet.octopart.com:443/RT0603BRD07100KL-Yageo-datasheet-166250672.pdf?src-supplier=Future+Electronics; ComponentLink4URL: https://datasheet.octopart.com:443/RT0603BRD07100KL-Yageo-datasheet-136673517.pdf?src-supplier=Future+Electronics; ComponentLink4Description: https://datasheet.octopart.com:443/RT0603BRD07100KL-Yageo-datasheet-136673517.pdf?src-supplier=Future+Electronics; ComponentLink5URL: https://datasheet.octopart.com:443/RT0603BRD07100KL-Yageo-datasheet-137700930.pdf?src-supplier=Future+Electronics; ComponentLink5Description: https://datasheet.octopart.com:443/RT0603BRD07100KL-Yageo-datasheet-137700930.pdf?src-supplier=Future+Electronics; ComponentLink6URL: https://datasheet.octopart.com:443/RT0603BRD07100KL-Yageo-datasheet-41589729.pdf?src-supplier=Future+Electronics; ComponentLink6Description: https://datasheet.octopart.com:443/RT0603BRD07100KL-Yageo-datasheet-41589729.pdf?src-supplier=Future+Electronics; ComponentLink7URL: https://datasheet.octopart.com:443/RT0603BRD07100KL-Yageo-datasheet-12594463.pdf?src-supplier=Future+Electronics; ComponentLink7Description: https://datasheet.octopart.com:443/RT0603BRD07100KL-Yageo-datasheet-12594463.pdf?src-supplier=Future+Electronics; ComponentLink8URL: https://datasheet.octopart.com:443/RT0603BRD07100KL-Yageo-datasheet-34924148.pdf?src-supplier=Future+Electronics; ComponentLink8Description: https://datasheet.octopart.com:443/RT0603BRD07100KL-Yageo-datasheet-34924148.pdf?src-supplier=Future+Electronics; ComponentLink9URL: https://datasheet.octopart.com:443/RT0603BRD07100KL-Yageo-datasheet-96443642.pdf?src-supplier=Upverter; ComponentLink9Description: https://datasheet.octopart.com:443/RT0603BRD07100KL-Yageo-datasheet-96443642.pdf?src-supplier=Upverter; ComponentLink10URL: https://datasheet.octopart.com:443/RT0603BRD07100KL-Yageo-datasheet-10915759.pdf?src-supplier=Burklin+Elektronik; ComponentLink10Description: https://datasheet.octopart.com:443/RT0603BRD07100KL-Yageo-datasheet-10915759.pdf?src-supplier=Burklin+Elektronik; ComponentLink11URL: https://datasheet.octopart.com:443/RT0603BRD07100KL-Yageo-Group-datasheet-141265893.pdf?src-supplier=ODG+(Origin+Data+Global); ComponentLink11Description: https://datasheet.octopart.com:443/RT0603BRD07100KL-Yageo-Group-datasheet-141265893.pdf?src-supplier=ODG+(Origin+Data+Global); ComponentLink12URL: https://datasheet.octopart.com/RT0603BRD07100KL-Yageo-datasheet-86813807.pdf; ComponentLink12Description: https://datasheet.octopart.com/RT0603BRD07100KL-Yageo-datasheet-86813807.pdf; ComponentLink13URL: http://sigma.octopart.com:80/conflict_mineral_statement/Yageo-company-3.pdf?src-supplier=Compliance+Statements; ComponentLink13Description: http://sigma.octopart.com:80/conflict_mineral_statement/Yageo-company-3.pdf?src-supplier=Compliance+Statements; ComponentLink14URL: http://sigma.octopart.com:80/rohs_statement/Yageo-company-2.pdf?src-supplier=Compliance+Statements; ComponentLink14Description: http://sigma.octopart.com:80/rohs_statement/Yageo-company-2.pdf?src-supplier=Compliance+Statements; JLCPCB Part Number: C122538